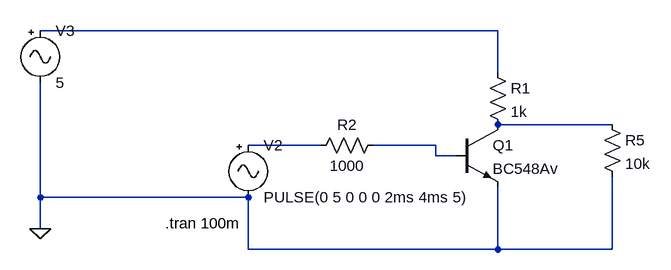
[diagram p0: schematic BC548_Teste1.asc]
BC548_Teste1.asc, the LTspice schematic file:
Version 4
SHEET 1 880 680
WIRE 416 0 -288 0
WIRE 416 64 416 0
WIRE 592 144 416 144
WIRE 144 176 32 176
WIRE 320 176 224 176
WIRE 320 192 320 176
WIRE 352 192 320 192
WIRE -288 256 -288 80
WIRE 32 256 -288 256
WIRE -288 304 -288 256
WIRE 32 336 32 256
WIRE 416 336 416 240
WIRE 416 336 32 336
WIRE 592 336 592 224
WIRE 592 336 416 336
FLAG -288 304 0
SYMBOL npn 352 144 R0
SYMATTR InstName Q1
SYMATTR Value BC548Av
SYMBOL res 400 48 R0
SYMATTR InstName R1
SYMATTR Value 1k
SYMBOL Misc\\signal 32 160 R0
WINDOW 123 0 0 Left 2
WINDOW 39 0 0 Left 2
SYMATTR InstName V2
SYMATTR Value PULSE(0 5 0 0 0 2ms 4ms 5)
SYMBOL Misc\\signal -288 -16 R0
WINDOW 123 0 0 Left 2
WINDOW 39 0 0 Left 2
SYMATTR InstName V3
SYMATTR Value 5
SYMBOL res 576 128 R0
SYMATTR InstName R5
SYMATTR Value 10k
SYMBOL res 240 160 R90
WINDOW 0 0 56 VBottom 2
WINDOW 3 32 56 VTop 2
SYMATTR InstName R2
SYMATTR Value 1000
TEXT -96 296 Left 2 !.tran 100m

The netlist it stands for:
* BC548_Teste1.asc
Q1 N002 N004 0 0 BC548Av
R1 N001 N002 1k
V2 N003 0 PULSE(0 5 0 0 0 2ms 4ms 5)
V3 N001 0 5
R5 N002 0 10k
R2 N004 N003 1000
.model NPN NPN
.model PNP PNP
.lib standard.bjt
.tran 100m
.backanno
.end